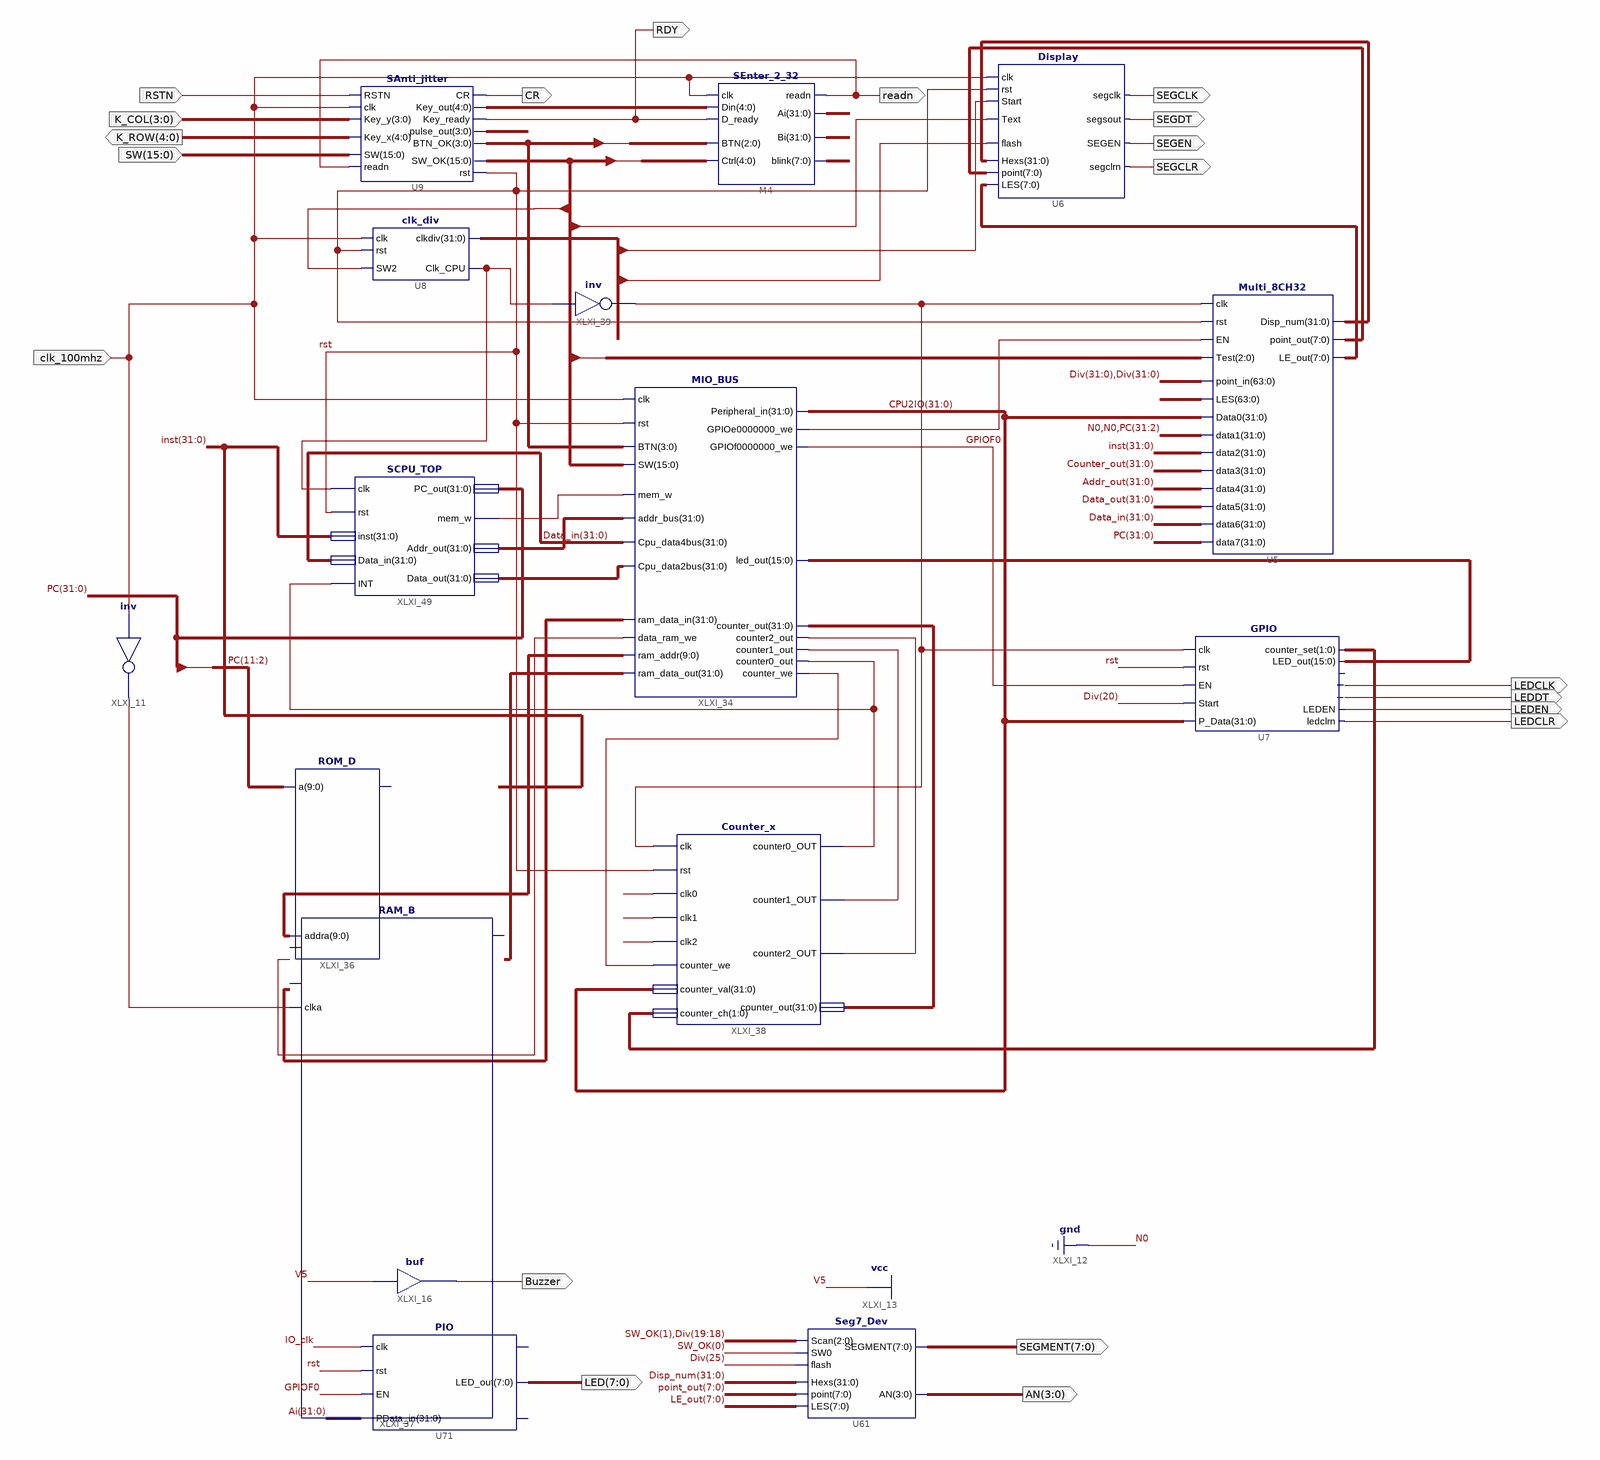
[diagram p0: schematic sheet 1]
// Xilinx ISE schematic OEXP01_MUX.sch (kintex7) as structural Verilog: 16 symbols, 20 ports
module OEXP01_MUX (
  input  RSTN,
  input  [3:0] K_COL,
  input  [15:0] SW,
  input  clk_100mhz,
  output [4:0] K_ROW,
  output CR,
  output RDY,
  output readn,
  output SEGCLK,
  output SEGDT,
  output SEGEN,
  output SEGCLR,
  output LEDCLR,
  output LEDEN,
  output LEDDT,
  output LEDCLK,
  output [7:0] LED,
  output [3:0] AN,
  output Buzzer,
  output [7:0] SEGMENT
);

  wire Clk_CPU, GPIOF0, IO_clk, rst, XLXN_52, XLXN_364, XLXN_388, XLXN_389, XLXN_391, XLXN_394, XLXN_401;
  wire [0:0] XLXN_271;
  wire [1:0] XLXN_385;
  wire [3:0] BTN_OK, Pulse;
  wire [4:0] XLXN_7;
  wire [7:0] blink, LE_out, point_out;
  wire [9:0] XLXN_272;
  wire [15:0] SW_OK, XLXN_383;
  wire [31:0] Addr_out, Ai, Bi, Counter_out, CPU2IO, Data_in, Data_out, Disp_num, Div, inst, PC, XLXN_270,
       XLXN_275, XLXN_400, XLXN_404;

  SAnti_jitter U9 (
    .SW(SW), .readn(readn), .Key_y(K_COL), .Key_x(K_ROW), .RSTN(RSTN), .clk(clk_100mhz), .Key_out(XLXN_7),
    .Key_ready(RDY), .CR(CR), .rst(rst), .SW_OK(SW_OK), .pulse_out(Pulse), .BTN_OK(BTN_OK));
  SEnter_2_32 M4 (
    .readn(readn), .Ai(Ai), .Bi(Bi), .blink(blink), .Din(XLXN_7), .D_ready(RDY), .clk(clk_100mhz),
    .Ctrl({SW_OK[7:5], SW_OK[15], SW_OK[0]}), .BTN(BTN_OK[2:0]));
  clk_div U8 (.rst(rst), .clk(clk_100mhz), .SW2(SW_OK[2]), .clkdiv(Div), .Clk_CPU(Clk_CPU));
  Display U6 (
    .LES(LE_out), .SEGEN(SEGEN), .segsout(SEGDT), .segclrn(SEGCLR), .point(point_out), .Hexs(Disp_num),
    .Text(SW_OK[0]), .flash(Div[25]), .segclk(SEGCLK), .clk(clk_100mhz), .rst(rst), .Start(Div[20]));
  Multi_8CH32 U5 (
    .Test(SW_OK[7:5]), .point_in({Div, Div}), .EN(XLXN_364), .clk(IO_clk), .rst(rst), .LES({64{1'b0}}),
    .Data0(CPU2IO), .data1({2'b00, PC[31:2]}), .data2(inst), .data3(Counter_out), .data4(Addr_out),
    .data5(Data_out), .data6(Data_in), .data7(PC), .point_out(point_out), .LE_out(LE_out), .Disp_num(Disp_num));
  not XLXI_11 (XLXN_52, clk_100mhz);
  MIO_BUS XLXI_34 (
    .rst(rst), .clk(clk_100mhz), .mem_w(XLXN_401), .addr_bus(XLXN_404), .Cpu_data4bus(Data_in),
    .Cpu_data2bus(XLXN_400), .ram_data_out(XLXN_275), .ram_addr(XLXN_272), .data_ram_we(XLXN_271[0]),
    .ram_data_in(XLXN_270), .counter_out(Counter_out), .counter2_out(XLXN_388), .counter1_out(XLXN_389),
    .counter0_out(XLXN_394), .counter_we(XLXN_391), .BTN(BTN_OK), .SW(SW_OK), .led_out(XLXN_383),
    .Peripheral_in(CPU2IO), .GPIOe0000000_we(XLXN_364), .GPIOf0000000_we(GPIOF0));
  ROM_D XLXI_36 (.a(PC[11:2]));  // open: spo
  RAM_B XLXI_37 (.addra(XLXN_272), .clka(XLXN_52));  // open: dina, wea, douta
  Counter_x XLXI_38 (
    .clk(IO_clk), .rst(rst), .clk0(Div[6]), .clk1(Div[9]), .clk2(Div[11]), .counter_we(XLXN_391),
    .counter_val(CPU2IO), .counter_ch(XLXN_385), .counter0_OUT(XLXN_394), .counter1_OUT(XLXN_389),
    .counter2_OUT(XLXN_388), .counter_out(Counter_out));
  not XLXI_39 (IO_clk, Clk_CPU);
  GPIO U7 (
    .clk(IO_clk), .P_Data(CPU2IO), .rst(rst), .EN(GPIOF0), .Start(Div[20]), .ledclk(LEDCLK),
    .LED_out(XLXN_383), .counter_set(XLXN_385), .ledclrn(LEDCLR), .LEDEN(LEDEN), .ledsout(LEDDT));  // open: GPIOf0
  PIO U71 (.clk(IO_clk), .rst(rst), .EN(GPIOF0), .PData_in(Ai), .LED_out(LED));  // open: GPIOf0, counter_set
  Seg7_Dev U61 (
    .LES(LE_out), .Scan({SW_OK[1], Div[19:18]}), .SEGMENT(SEGMENT), .AN(AN), .point(point_out),
    .flash(Div[25]), .SW0(SW_OK[0]), .Hexs(Disp_num));
  buf XLXI_16 (Buzzer, 1'b1);
  SCPU_TOP XLXI_49 (
    .clk(Clk_CPU), .rst(rst), .inst(inst), .Data_in(Data_in), .INT(XLXN_394), .PC_out(PC), .mem_w(XLXN_401),
    .Addr_out(XLXN_404), .Data_out(XLXN_400));
endmodule
